# Altium schematic sheet 00 - Overview.SchDoc
size A4; Date: 13/4/18; Author: LS, OB, AG; DrawnBy: LS, OB, AB, AG, IM; Organization: Miromico, ETHZ; Revision: 3; SheetNumber: 1; SheetTotal: 5; SchemaTitle: Overview; ProjectName: Transient BLE System
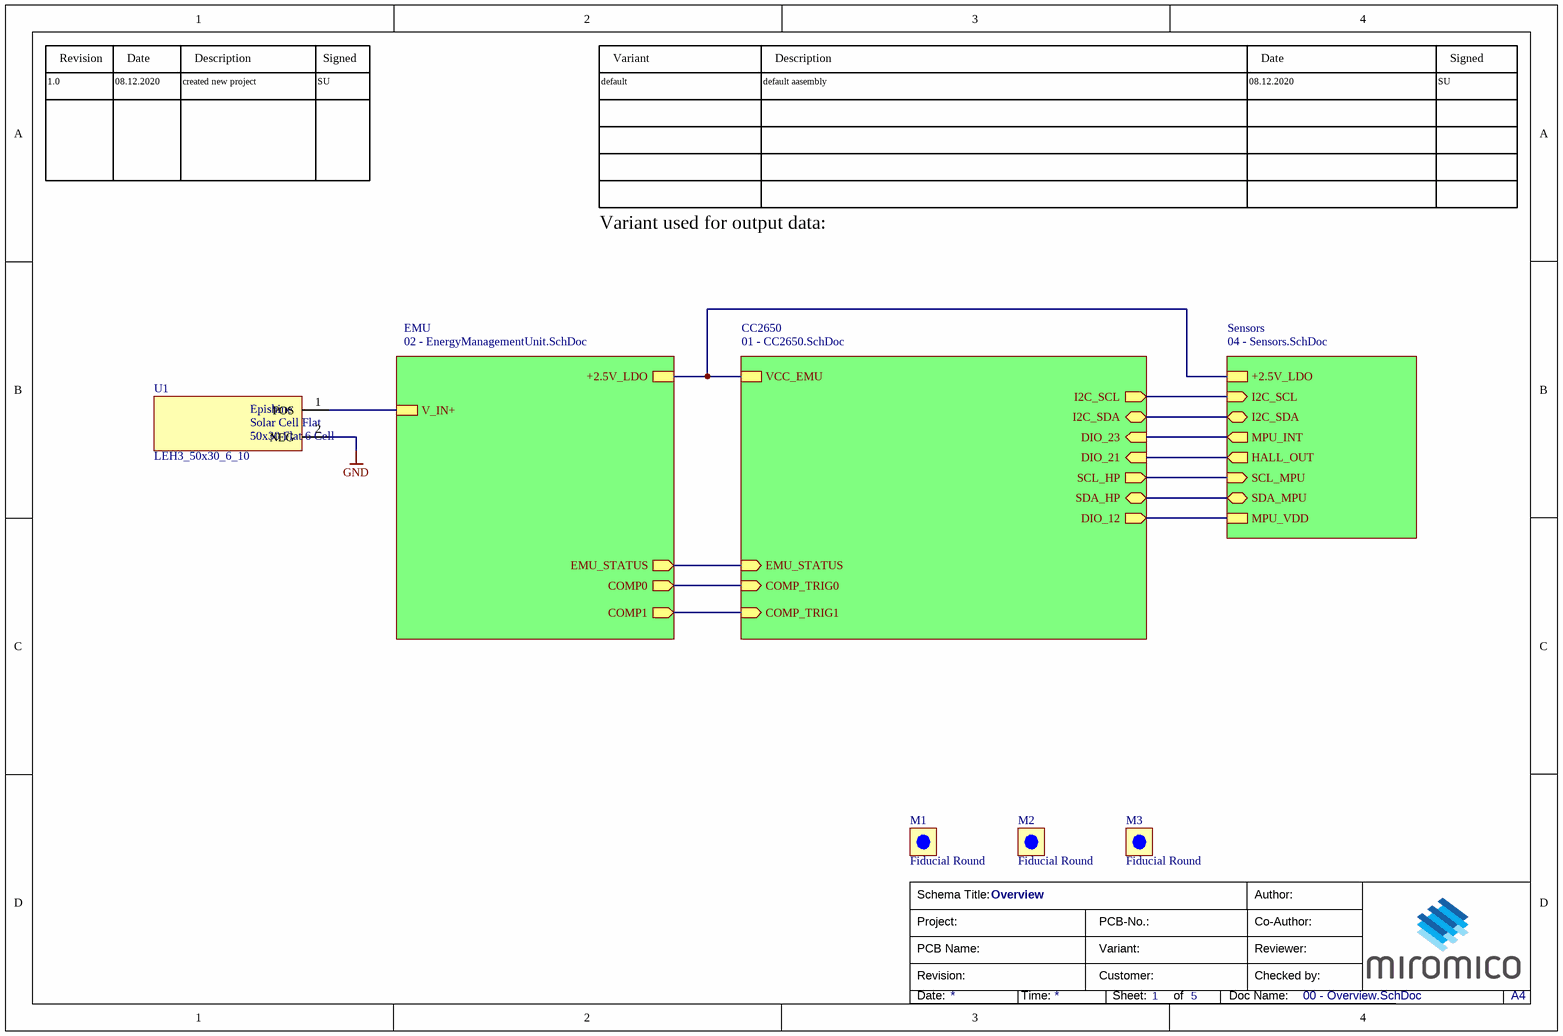
[diagram p0: 00 - Overview.SchDoc]

## Parts
M1  Fiducial Round  [Fiducial round_small]  (no BOM)
M2  Fiducial Round  [Fiducial round_small]  (no BOM)
M3  Fiducial Round  [Fiducial round_small]  (no BOM)
U1  LEH3_50x30_6_10  [50x30 Flat 6 Cell - Gen 2-Footprint-1]

## Sub-sheets
CC2650 = 01 - CC2650.SchDoc: I2C_SCL (out), I2C_SDA (bidir), EMU_STATUS (in), COMP_TRIG0 (in), VCC_EMU, DIO_23 (in), DIO_21 (in), SCL_HP (out), SDA_HP (bidir), DIO_12 (out), COMP_TRIG1 (in)
EMU = 02 - EnergyManagementUnit.SchDoc: V_IN+, EMU_STATUS (out), COMP0 (out), +2.5V_LDO, COMP1 (out)
Sensors = 04 - Sensors.SchDoc: I2C_SCL (in), I2C_SDA (bidir), MPU_INT (out), +2.5V_LDO, HALL_OUT (out), SCL_MPU (in), SDA_MPU (bidir), MPU_VDD

## Nets
GND: U1.2(NEG)
NetU1_1: U1.1(POS) ; sheet EMU/V_IN+
(unnamed): sheet CC2650/I2C_SCL, sheet Sensors/I2C_SCL
(unnamed): sheet CC2650/I2C_SDA, sheet Sensors/I2C_SDA
(unnamed): sheet CC2650/EMU_STATUS, sheet EMU/EMU_STATUS
(unnamed): sheet CC2650/COMP_TRIG0, sheet EMU/COMP0
(unnamed): sheet CC2650/VCC_EMU, sheet EMU/+2.5V_LDO, sheet Sensors/+2.5V_LDO
(unnamed): sheet CC2650/DIO_23, sheet Sensors/MPU_INT
(unnamed): sheet CC2650/DIO_21, sheet Sensors/HALL_OUT
(unnamed): sheet CC2650/SCL_HP, sheet Sensors/SCL_MPU
(unnamed): sheet CC2650/SDA_HP, sheet Sensors/SDA_MPU
(unnamed): sheet CC2650/DIO_12, sheet Sensors/MPU_VDD
(unnamed): sheet CC2650/COMP_TRIG1, sheet EMU/COMP1

## Notes on the sheet
- 1.0
- Revision
- 08.12.2020
- Date
- created new project
- Description
- SU
- Signed
- default
- Variant
- default aasembly
- Variant used for output data:
- Schema Title:
- Project:
- PCB-No.:
- Author:
- Co-Author:
- Revision:
- PCB Name:
- Customer:
- Variant:
- Reviewer:
- Checked by:
- Date:
- Time:
- Sheet:
- of
- Doc Name:
- A4
- (in symbol CMP-00499-06) Solar Cell Flat; 50x30 Flat 6 Cell

## Library data of the parts
M1-M3 = Fiducial Round-10: Fiducial (Optical Marker)
U1 = CMP-00499-06: Solar Cell 50x30 Flat 6 Cell; Manufacturer: Epishine; ComponentLink1Description: Datasheet; Manufacturer Part Number: LEH3_50x30_6_10; Supplier 1: Epishine; Supplier Part Number 1: LEH3_50x30_6_10